# Altium schematic sheet ADC.SchDoc
size A4; SheetNumber: 2; SheetTotal: 2
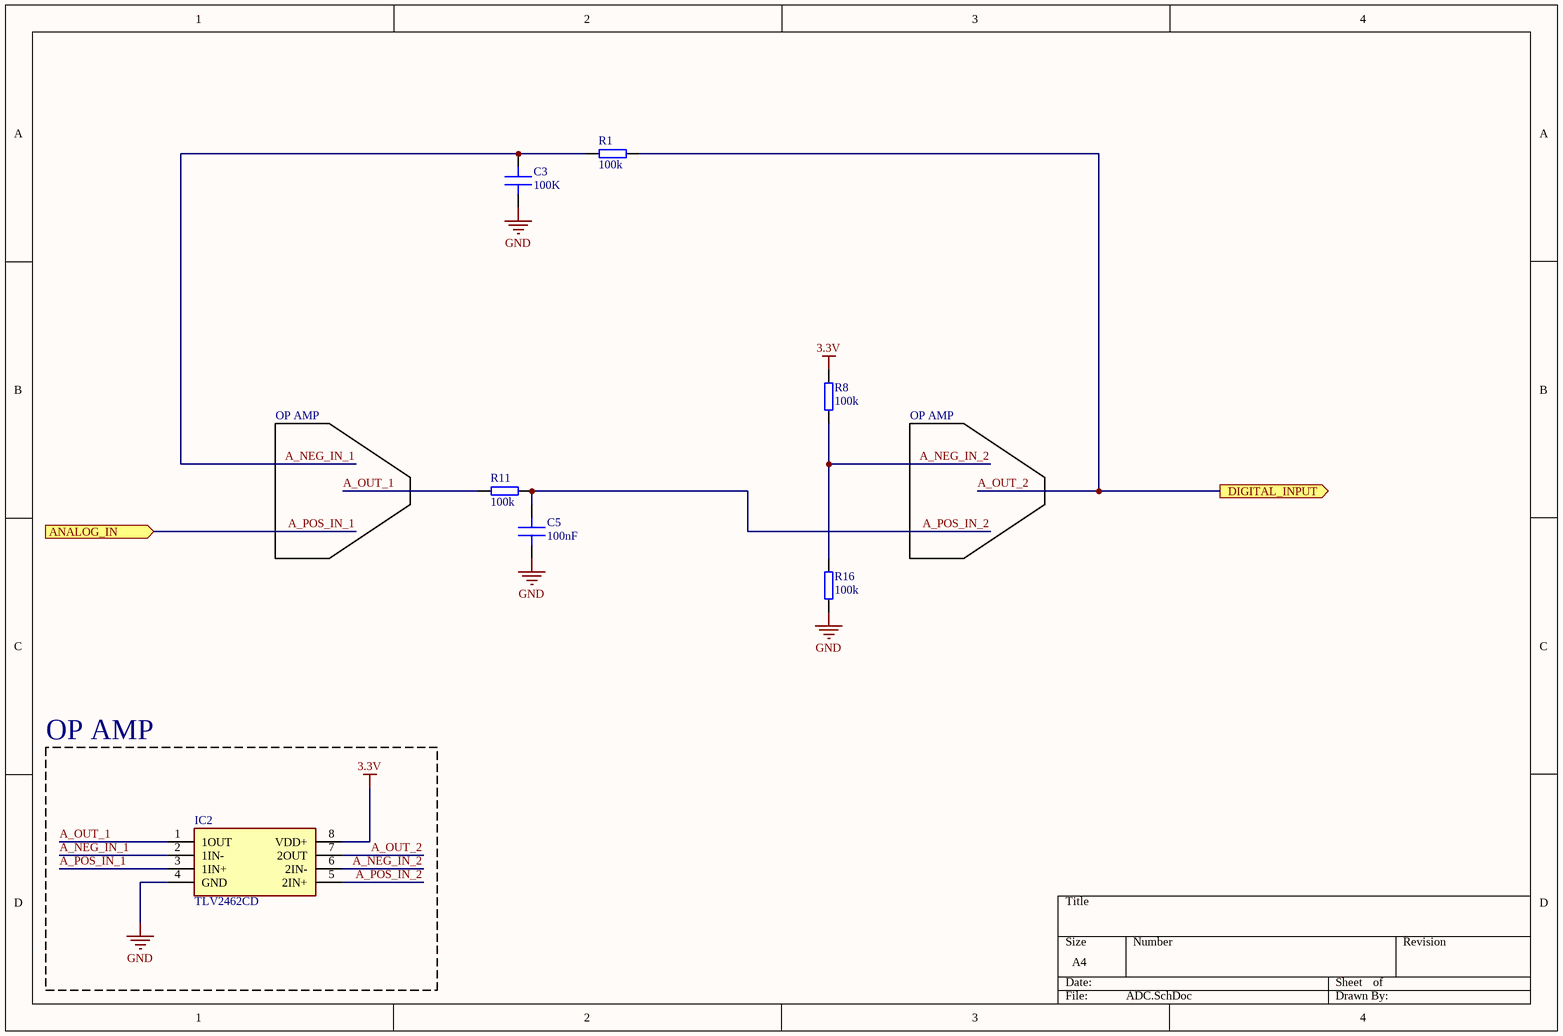
[diagram p0: ADC.SchDoc]

## Parts
C3  100K  [C 0402]
C5  100nF  [C 0402]
IC2  TLV2462CD  [SOIC127P600X175-8N]
R1  100k  [R 0402]
R8  100k  [R 0402]
R11  100k  [R 0402]
R16  100k  [R 0402]

## Blocks framed on the sheet
OP AMP: IC2

## Ports
ANALOG_IN (in), DIGITAL_INPUT (out)

## Nets
3.3V: IC2.8(VDD+) R8.1
GND: C3.2 C5.2 IC2.4(GND) R16.2
A_NEG_IN_1: C3.1 IC2.2(1IN-) R1.2
A_NEG_IN_2: IC2.6(2IN-) R8.2 R16.1
A_OUT_1: IC2.1(1OUT) R11.2
A_OUT_2: IC2.7(2OUT) R1.1 ; port DIGITAL_INPUT
A_POS_IN_1: IC2.3(1IN+) ; port ANALOG_IN
A_POS_IN_2: C5.1 IC2.5(2IN+) R11.1

## Notes on the sheet
- OP AMP

## Library data of the parts
C3 C5 = Capacitor: MLCC Capacitor
IC2 = TLV2462CD: Integrated Circuit; Manufacturer_Name: Texas Instruments; Datasheet Link: http://www.ti.com/lit/ds/symlink/tlv2462.pdf; Height: 1.75mm; Manufacturer_Part_Number: TLV2462CD; Mouser Part Number: 595-TLV2462CD; Mouser Price/Stock: https://www.mouser.co.uk/ProductDetail/Texas-Instruments/TLV2462CD?qs=ZA235jQDfbpG9ihY0Sx8Cg%3D%3D; Arrow Part Number: TLV2462CD; Arrow Price/Stock: https://www.arrow.com/en/products/tlv2462cd/texas-instruments?region=nac
R1 R8 R11 R16 = Resistor: General pourpouse resistor